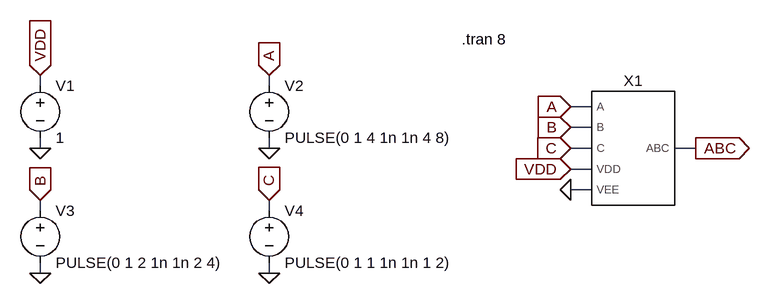
[diagram p0: schematic 3_Input_AND_Gate_Symbol_Test.asc]
3_Input_AND_Gate_Symbol_Test.asc, the LTspice schematic file:
Version 4
SHEET 1 880 704
WIRE -336 256 -336 240
WIRE 16 256 16 240
WIRE 512 288 480 288
WIRE 512 320 480 320
WIRE -336 352 -336 336
WIRE 16 352 16 336
WIRE 512 352 480 352
WIRE 672 352 640 352
WIRE 512 384 480 384
WIRE 512 416 480 416
WIRE -336 448 -336 432
WIRE 16 448 16 432
WIRE -336 544 -336 528
WIRE 16 544 16 528
FLAG 16 352 0
FLAG -336 352 0
FLAG -336 544 0
FLAG 16 544 0
FLAG -336 240 VDD
IOPIN -336 240 In
FLAG 480 384 VDD
IOPIN 480 384 In
FLAG 480 416 0
FLAG 16 240 A
IOPIN 16 240 In
FLAG 480 288 A
IOPIN 480 288 In
FLAG 480 320 B
IOPIN 480 320 In
FLAG -336 432 B
IOPIN -336 432 In
FLAG 480 352 C
IOPIN 480 352 In
FLAG 16 432 C
IOPIN 16 432 In
FLAG 672 352 ABC
IOPIN 672 352 Out
SYMBOL 3_Input_AND_Gate_Symbol 576 352 R0
SYMATTR InstName X1
SYMBOL Voltage -336 240 R0
SYMATTR InstName V1
SYMATTR Value 1
SYMBOL Voltage 16 240 R0
SYMATTR InstName V2
SYMATTR Value PULSE(0 1 4 1n 1n 4 8)
SYMBOL Voltage -336 432 R0
SYMATTR InstName V3
SYMATTR Value PULSE(0 1 2 1n 1n 2 4)
SYMBOL Voltage 16 432 R0
SYMATTR InstName V4
SYMATTR Value PULSE(0 1 1 1n 1n 1 2)
TEXT 312 184 Left 2 !.tran 8

The netlist it stands for:
* 3_Input_AND_Gate_Symbol_Test.asc
XX1 A B C VDD 0 ABC 3_Input_AND_Gate_Symbol  ; pins A B C VDD VEE ABC
V1 VDD 0 1
V2 A 0 PULSE(0 1 4 1n 1n 4 8)
V3 B 0 PULSE(0 1 2 1n 1n 2 4)
V4 C 0 PULSE(0 1 1 1n 1n 1 2)
.tran 8
.backanno
.end